# Altium schematic sheet [2]_Ethernet_SDCard.SchDoc
size A3; DocumentNumber: 2; SheetNumber: 2; SheetTotal: 9; PageSetup: Record=PageOptions|CenterHorizontal=True|CenterVertical=True|PrintScale=0.97|XCorrection=1.00|YCorrection=1.00|PrintKind=1|BorderSize=5000000|LeftOffset=0|BottomOffset=0|Orientation=2|PaperLength=2970|PaperWidth=2100|Scale=100|PaperSource=7|PrintQuality=600|MediaType=1|DitherType=10|PaperKind=A4|PrintScaleMode=1
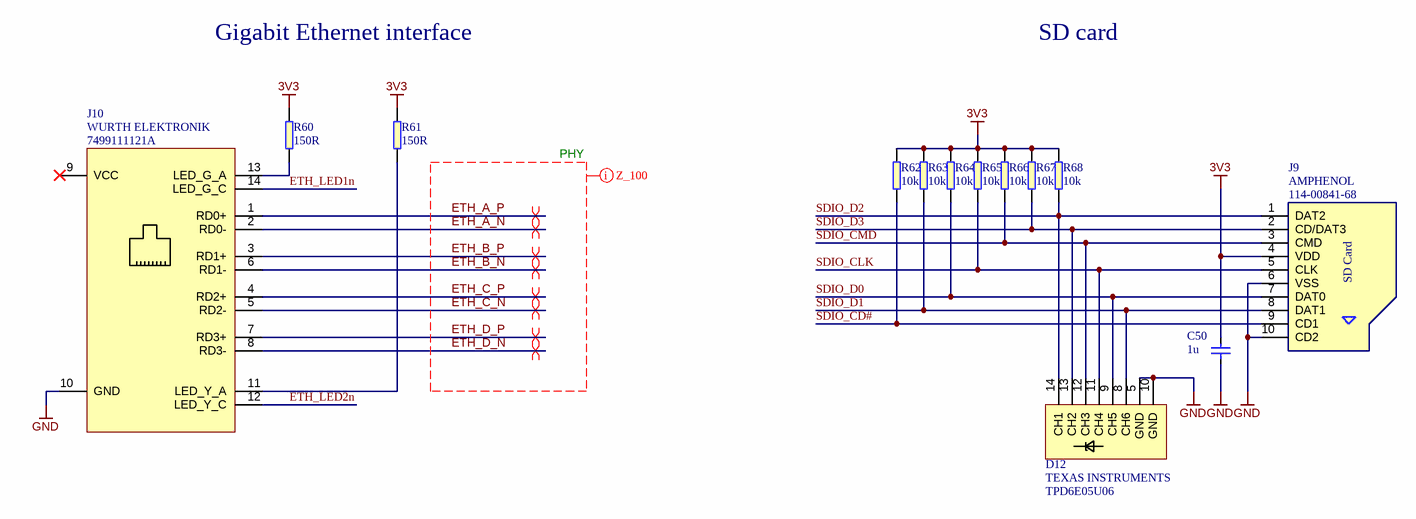
[diagram p0: [2]_Ethernet_SDCard.SchDoc]

## Parts
C50  1u  [0603]
D12  Manufacturer: TEXAS INSTRUMENTS  [TPD6E05U06_PASS]  (hidden comment: TPD6E05U06)
J9  Manufacturer: AMPHENOL  [114-00841-68]  (hidden comment: 114-00841-68)
J10  Manufacturer: WURTH ELEKTRONIK  [WE_7499111121A]  (hidden comment: 7499111121A)
R60  150R  [0402]
R61  150R  [0402]
R62  10k  [0402]
R63  10k  [0402]
R64  10k  [0402]
R65  10k  [0402]
R66  10k  [0402]
R67  10k  [0402]
R68  10k  [0402]

## Nets
3V3: C50.2 J9.4(VDD) R60.2 R61.2 R62.2 R63.2 R64.2 R65.2 R66.2 R67.2 R68.2
GND: C50.1 D12.5(GND) D12.10(GND) J9.6(VSS) J9.10(CD2) J10.10(GND)
ETH_A_N: J10.2(RD0-)
ETH_A_P: J10.1(RD0+)
ETH_B_N: J10.6(RD1-)
ETH_B_P: J10.3(RD1+)
ETH_C_N: J10.5(RD2-)
ETH_C_P: J10.4(RD2+)
ETH_D_N: J10.8(RD3-)
ETH_D_P: J10.7(RD3+)
ETH_LED1n: J10.14(LED_G_C)
ETH_LED2n: J10.12(LED_Y_C)
SDIO_CD#: J9.9(CD1) R62.1
SDIO_CLK: D12.11(CH4) J9.5(CLK) R65.1
SDIO_CMD: D12.12(CH3) J9.3(CMD) R66.1
SDIO_D0: D12.9(CH5) J9.7(DAT0) R64.1
SDIO_D1: D12.8(CH6) J9.8(DAT1) R63.1
SDIO_D2: D12.14(CH1) J9.1(DAT2) R68.1
SDIO_D3: D12.13(CH2) J9.2(CD/DAT3) R67.1
NetJ10_11: J10.11(LED_Y_A) R61.1
NetJ10_13: J10.13(LED_G_A) R60.1

Not connected (* = marked no-connect by the designer): J10 9(VCC)*

## Layout directives
differential pair: ETH_A_N, ETH_A_P, ETH_B_N, ETH_B_P, ETH_C_N, ETH_C_P, ETH_D_N, ETH_D_P
Z_100: 100: ETH_A_N, ETH_A_P, ETH_B_N, ETH_B_P, ETH_C_N, ETH_C_P, ETH_D_N, ETH_D_P

## Notes on the sheet
- Gigabit Ethernet interface
- SD card
- PHY
- Title:
- Size:
- Date:
- A3
- Revision:
- Page:
- of
- Antmicro Ltd.
- File:
- www.antmicro.com
- (in symbol Micro_SD) SD Card

## Library data of the parts
C50 = C_1u_0603: MLCC SMT Capacitor 1u 0603; Manufacturer: MULTICOMP; Part Symbol: MC0603X105M6R3CT; Tolerance: +-20%; Voltage: 6.3V; Value: 1u; Part Number: C_1u_0603
D12 = TPD6E05U06: ESD Suppressors 6-CH Pass through layout; Part Symbol: TPD6E05U06RVZR; Part Number: TPD6E05U06_PASS; Value: TPD6E05U06
J9 = Micro_SD: Micro SD card holder; Part Number: AMP-114-00841-68; Value: 114-00841-68; Part Symbol: 114-00841-68
J10 = WE_7499111121A: CONN MAGJACK 1PORT 1000 BASE-T; Part Number: WE_7499111121A; Value: 7499111121A; Part Symbol: 7499111121A
R60 R61 = R_150R_0402: SMT Resistor 150R_0402; Manufacturer: VISHAY; Part Symbol: CRCW0402150RFKED; Tolerance: 1%; Part Number: R_150R_0402; Value: 150R
R62-R68 = R_10k_0402: SMT Resistor 10k 0402; Manufacturer: MULTICOMP; Part Symbol: MCMR04X1002FTL; Tolerance: 1%; Value: 10k; Part Number: R_10k_0402